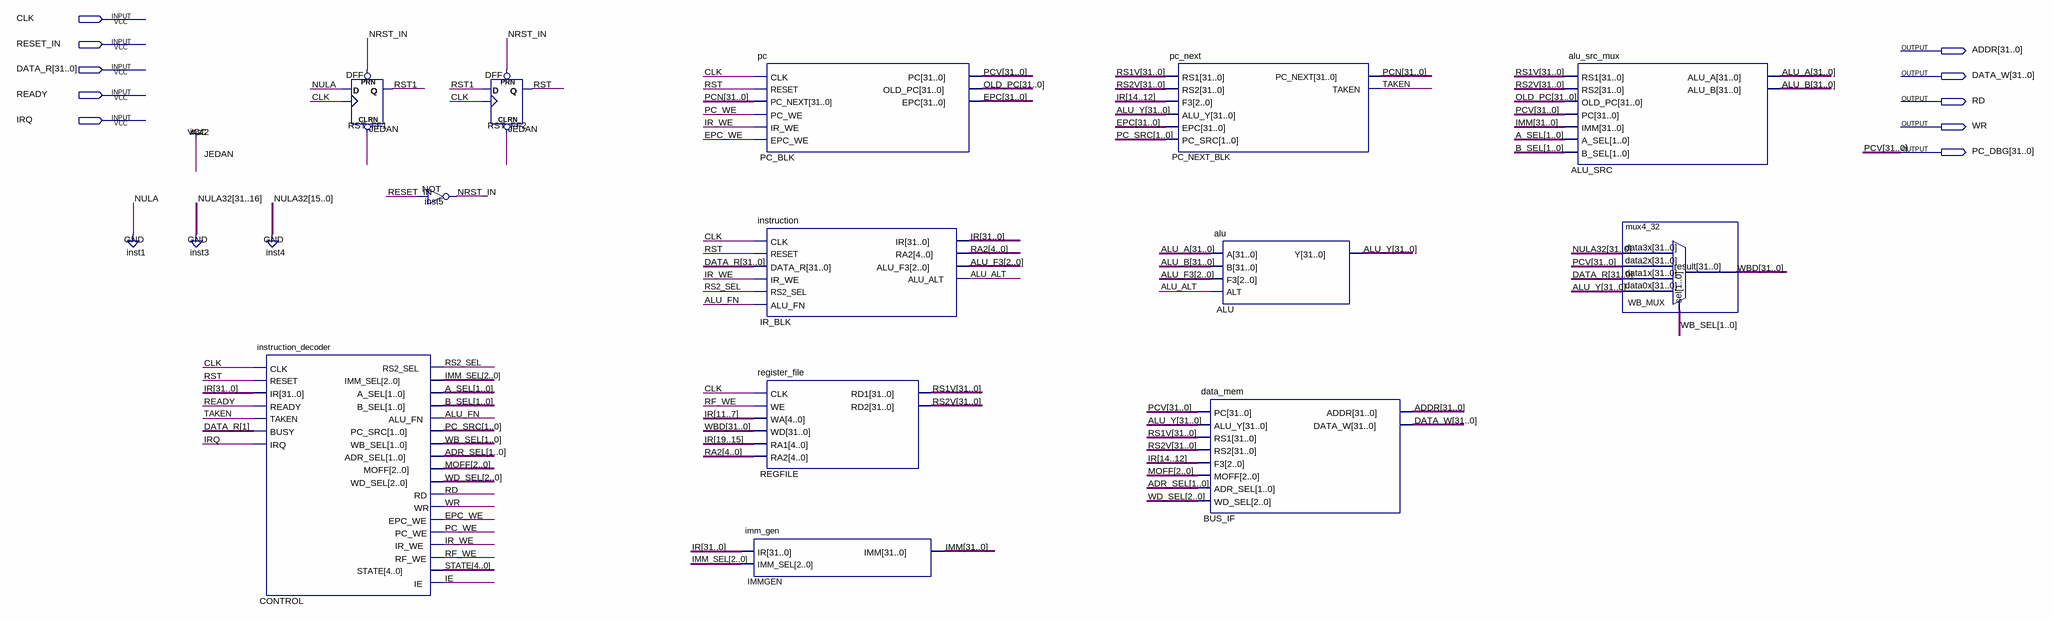
[diagram p0: schematic sheet]
// Quartus schematic tetris_cpu.bdf as structural Verilog: 13 symbols, 10 pins
module tetris_cpu (
  input  CLK,
  input  RESET_IN,
  input  [31:0] DATA_R,
  input  READY,
  input  IRQ,
  output [31:0] ADDR,
  output [31:0] DATA_W,
  output RD,
  output WR,
  output [31:0] PC_DBG
);

  wire ALU_ALT, ALU_FN, EPC_WE, IE, IR_WE, NRST_IN, PC_WE, RF_WE, RS2_SEL, RST, RST1, TAKEN;
  wire [1:0] A_SEL, ADR_SEL, B_SEL, PC_SRC, WB_SEL;
  wire [2:0] ALU_F3, IMM_SEL, MOFF, WD_SEL;
  wire [4:0] RA2, STATE;
  wire [31:0] ALU_A, ALU_B, ALU_Y, EPC, IMM, IR, OLD_PC, PCN, RS1V, RS2V, WBD;

  instruction_decoder CONTROL (
    .CLK(CLK), .RESET(RST), .IR(IR), .READY(READY), .TAKEN(TAKEN), .BUSY(DATA_R[1]), .IRQ(IRQ),
    .RS2_SEL(RS2_SEL), .IMM_SEL(IMM_SEL), .A_SEL(A_SEL), .B_SEL(B_SEL), .ALU_FN(ALU_FN), .PC_SRC(PC_SRC),
    .WB_SEL(WB_SEL), .ADR_SEL(ADR_SEL), .MOFF(MOFF), .WD_SEL(WD_SEL), .RD(RD), .WR(WR), .EPC_WE(EPC_WE),
    .PC_WE(PC_WE), .IR_WE(IR_WE), .RF_WE(RF_WE), .STATE(STATE), .IE(IE));
  DFF RST_FF1 (.CLRN(1'b1), .CLK(CLK), .D(1'b0), .PRN(NRST_IN), .Q(RST1));
  not inst5 (NRST_IN, RESET_IN);
  DFF RST_FF2 (.CLRN(1'b1), .CLK(CLK), .D(RST1), .PRN(NRST_IN), .Q(RST));
  pc PC_BLK (
    .CLK(CLK), .RESET(RST), .PC_NEXT(PCN), .PC_WE(PC_WE), .IR_WE(IR_WE), .EPC_WE(EPC_WE), .PC(PC_DBG),
    .OLD_PC(OLD_PC), .EPC(EPC));
  instruction IR_BLK (
    .CLK(CLK), .RESET(RST), .DATA_R(DATA_R), .IR_WE(IR_WE), .RS2_SEL(RS2_SEL), .ALU_FN(ALU_FN), .IR(IR),
    .RA2(RA2), .ALU_F3(ALU_F3), .ALU_ALT(ALU_ALT));
  register_file REGFILE (
    .CLK(CLK), .WE(RF_WE), .WA(IR[11:7]), .WD(WBD), .RA1(IR[19:15]), .RA2(RA2), .RD1(RS1V), .RD2(RS2V));
  imm_gen IMMGEN (.IR(IR), .IMM_SEL(IMM_SEL), .IMM(IMM));
  pc_next PC_NEXT_BLK (
    .RS1(RS1V), .RS2(RS2V), .F3(IR[14:12]), .ALU_Y(ALU_Y), .EPC(EPC), .PC_SRC(PC_SRC), .PC_NEXT(PCN),
    .TAKEN(TAKEN));
  alu ALU (.A(ALU_A), .B(ALU_B), .F3(ALU_F3), .ALT(ALU_ALT), .Y(ALU_Y));
  data_mem BUS_IF (
    .PC(PC_DBG), .ALU_Y(ALU_Y), .RS1(RS1V), .RS2(RS2V), .F3(IR[14:12]), .MOFF(MOFF), .ADR_SEL(ADR_SEL),
    .WD_SEL(WD_SEL), .ADDR(ADDR), .DATA_W(DATA_W));
  alu_src_mux ALU_SRC (
    .RS1(RS1V), .RS2(RS2V), .OLD_PC(OLD_PC), .PC(PC_DBG), .IMM(IMM), .A_SEL(A_SEL), .B_SEL(B_SEL),
    .ALU_A(ALU_A), .ALU_B(ALU_B));
  mux4_32 WB_MUX (.data3x({32{1'b0}}), .data2x(PC_DBG), .data1x(DATA_R), .data0x(ALU_Y), .sel(WB_SEL), .result(WBD));

  // Other names for the same wires on the sheet: PCV[31:0] = PC_DBG
endmodule
